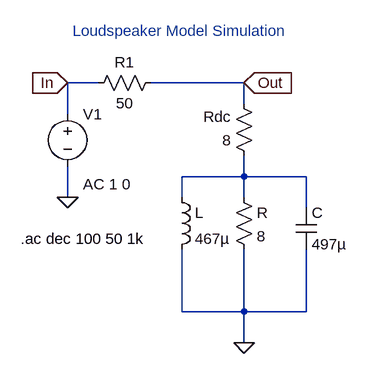
[diagram p0: schematic loudspeaker_sim.asc]
loudspeaker_sim.asc, the LTspice schematic file:
Version 4
SHEET 1 880 680
WIRE 160 96 112 96
WIRE 384 96 240 96
WIRE 384 128 384 96
WIRE 112 144 112 96
WIRE 384 240 384 208
WIRE 384 240 288 240
WIRE 480 240 384 240
WIRE 112 272 112 224
WIRE 288 272 288 240
WIRE 384 272 384 240
WIRE 480 288 480 240
WIRE 288 448 288 352
WIRE 384 448 384 352
WIRE 384 448 288 448
WIRE 480 448 480 352
WIRE 480 448 384 448
WIRE 384 496 384 448
FLAG 112 272 0
FLAG 384 496 0
FLAG 112 96 In
IOPIN 112 96 In
FLAG 384 96 Out
IOPIN 384 96 In
SYMBOL ind 272 256 R0
SYMATTR InstName L
SYMATTR Value 467µ
SYMBOL res 368 256 R0
SYMATTR InstName R
SYMATTR Value 8
SYMBOL cap 464 288 R0
SYMATTR InstName C
SYMATTR Value 497µ
SYMBOL voltage 112 128 R0
WINDOW 3 24 152 Left 2
WINDOW 123 24 124 Left 2
WINDOW 39 0 0 Left 0
SYMATTR Value ""
SYMATTR Value2 AC 1 0
SYMATTR InstName V1
SYMBOL res 256 80 R90
WINDOW 0 0 56 VBottom 2
WINDOW 3 32 56 VTop 2
SYMATTR InstName R1
SYMATTR Value 50
SYMBOL res 400 224 R180
WINDOW 0 36 76 Left 2
WINDOW 3 36 40 Left 2
SYMATTR InstName Rdc
SYMATTR Value 8
TEXT 40 336 Left 2 !.ac dec 100 50 1k
TEXT 120 16 Left 2 ;Loudspeaker Model Simulation

The netlist it stands for:
* loudspeaker_sim.asc
L N001 0 467µ
R N001 0 8
C N001 0 497µ
V1 In 0 AC 1 0
R1 Out In 50
Rdc N001 Out 8
.ac dec 100 50 1k
* Loudspeaker Model Simulation
.backanno
.end